# Altium project GAPses_breakout_pcb.PrjPcb
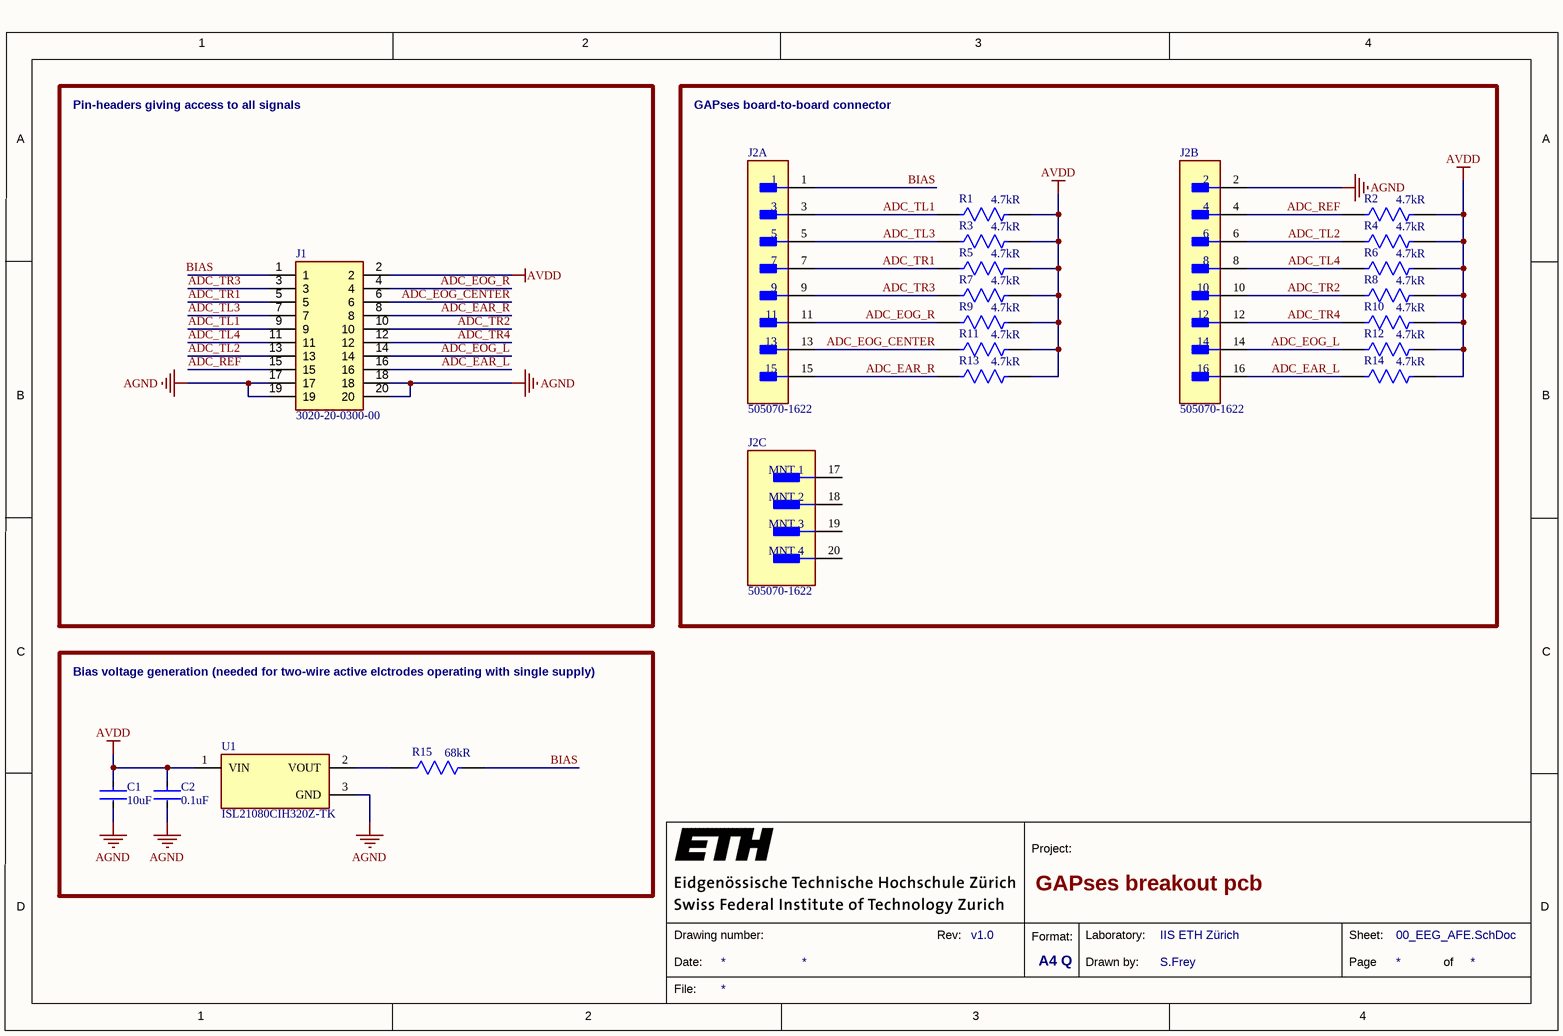
[diagram p0: 00_EEG_AFE.SchDoc]
DrawnBy: S.Frey; Organization: IIS ETH Zürich; revision: v1.0; title: GAPses breakout pcb
1 sheet, 20 parts. Net scope: global (net labels, ports and power ports of the same name join across sheets).
Board file: breakout_pcb.PcbDoc

## Sheet 00_EEG_AFE.SchDoc: GAPses breakout pcb
size A4

### Parts
C1  Capacitance: 10uF  [FP-CL07-IPC_C]  (hidden comment: CL05A106MP8NUB8)
C2  Capacitance: 0.1uF  [FP-CL278-IPC_C]  (hidden comment: CL05A104KA5NNNC)
J1  3020-20-0300-00  [302020030000]
J2  505070-1622  [FP-505070-1622-MFG]  (parts A,B,C of 3)
R1  Resistance: 4.7kR  [FP-RR0510-IPC_C]  (hidden comment: RR0510P-472-D)
R2  Resistance: 4.7kR  [FP-RR0510-IPC_C]  (hidden comment: RR0510P-472-D)
R3  Resistance: 4.7kR  [FP-RR0510-IPC_C]  (hidden comment: RR0510P-472-D)
R4  Resistance: 4.7kR  [FP-RR0510-IPC_C]  (hidden comment: RR0510P-472-D)
R5  Resistance: 4.7kR  [FP-RR0510-IPC_C]  (hidden comment: RR0510P-472-D)
R6  Resistance: 4.7kR  [FP-RR0510-IPC_C]  (hidden comment: RR0510P-472-D)
R7  Resistance: 4.7kR  [FP-RR0510-IPC_C]  (hidden comment: RR0510P-472-D)
R8  Resistance: 4.7kR  [FP-RR0510-IPC_C]  (hidden comment: RR0510P-472-D)
R9  Resistance: 4.7kR  [FP-RR0510-IPC_C]  (hidden comment: RR0510P-472-D)
R10  Resistance: 4.7kR  [FP-RR0510-IPC_C]  (hidden comment: RR0510P-472-D)
R11  Resistance: 4.7kR  [FP-RR0510-IPC_C]  (hidden comment: RR0510P-472-D)
R12  Resistance: 4.7kR  [FP-RR0510-IPC_C]  (hidden comment: RR0510P-472-D)
R13  Resistance: 4.7kR  [FP-RR0510-IPC_C]  (hidden comment: RR0510P-472-D)
R14  Resistance: 4.7kR  [FP-RR0510-IPC_C]  (hidden comment: RR0510P-472-D)
R15  Resistance: 68kR  [FP-RR0510-MFG]  (hidden comment: RR0510P-683-D)
U1  ISL21080CIH320Z-TK  [FP-P3_064A-IPC_C]

### Blocks framed on the sheet
Pin-headers giving access to all signals: J1
GAPses board-to-board connector: J2 R1-R14

### Nets
AGND: C1.2 C2.2 J1.17 J1.18 J1.19 J1.20 J2.2 U1.3(GND)
AVDD: C1.1 C2.1 J1.2 R1.2 R2.2 R3.2 R4.2 R5.2 R6.2 R7.2 R8.2 R9.2 R10.2 R11.2 R12.2 R13.2 R14.2 U1.1(VIN)
ADC_EAR_L: J1.16 J2.16 R14.1
ADC_EAR_R: J1.8 J2.15 R13.1
ADC_EOG_CENTER: J1.6 J2.13 R11.1
ADC_EOG_L: J1.14 J2.14 R12.1
ADC_EOG_R: J1.4 J2.11 R9.1
ADC_REF: J1.15 J2.4 R2.1
ADC_TL1: J1.9 J2.3 R1.1
ADC_TL2: J1.13 J2.6 R4.1
ADC_TL3: J1.7 J2.5 R3.1
ADC_TL4: J1.11 J2.8 R6.1
ADC_TR1: J1.5 J2.7 R5.1
ADC_TR2: J1.10 J2.10 R8.1
ADC_TR3: J1.3 J2.9 R7.1
ADC_TR4: J1.12 J2.12 R10.1
BIAS: J1.1 J2.1 R15.2
NetR15_1: R15.1 U1.2(VOUT)

Not connected (* = marked no-connect by the designer): J2 17(MNT_1) 18(MNT_2) 19(MNT_3) 20(MNT_4)

### Notes on the sheet
- Bias voltage generation (needed for two-wire active elctrodes operating with single supply)
- 1
- 2
- 3
- 4
- A
- B
- C
- Project:
- D
- Date:
- Drawing number:
- Rev:
- Format:
- A4 Q
- Drawn by:
- Laboratory:
- Page
- Sheet:
- of
- File:

### Library data of the parts
C1 = CMP-13271-002778-1: Cap Ceramic 10uF 10V X5R ±20% SMD 0402 +85°C Paper T/R; Length: 0.039inch; Mount: Surface Mount; Case Code (Imperial): 0402; Max Operating Temperature: 85°C; Voltage Rating: 10V; Min Operating Temperature: -55°C; Case/Package: 0402; Thickness: 0.035inch; Width: 0.02inch; Case Code (Metric): 1005; Packaging: Tape and Reel; Tolerance: 20%
C2 = CMP-13271-000728-1: Cap Ceramic 100nF 25V X5R ±10% SMD 0402 +85°C Paper T/R; Package Quantity: 1; Height: 0.5mm; Case Code (Metric): 1005; Thickness: 0.022inch; Mount: Surface Mount; Lead Free: Lead Free; Case Code (Imperial): 0402; Packaging: Tape and Reel; Depth: 0.5mm; Voltage: 25V; Min Operating Temperature: -55°C; Voltage Rating: 25V; Dielectric: X5R; Case/Package: 0402; Tolerance: 10%; Width: 0.02inch; Max Operating Temperature: 85°C; Length: 1mm; Radiation Hardening: No; Voltage Rating (DC): 25V
J1 = 3020-20-0300-00: Connector; Manufacturer_Name: CNC Tech; Datasheet Link: http://cnctech.us/pdfs/3020-XX-0300-00.pdf; Height: 9mm; Manufacturer_Part_Number: 3020-20-0300-00; Arrow Part Number: 3020-20-0300-00; Arrow Price/Stock: https://www.arrow.com/en/products/3020-20-0300-00/cnc-tech-llc?region=nac
J2 = CMP-04776-000181-1: CONN PLUG 16POS SMD GOLD
R1-R14 = CMP-2002-01621-2: 4.7kΩ ±0.5% 0.0625W 1/16W Chip Resistor 0402 (1005 Metric) Thin Film; Temperature Coefficient: 25ppm/°C; Voltage Rating: 25V; Power Rating: 63mW; Tolerance: 0.5%; Size Code: 0402; Lead Free: Lead Free; Length: 0.039inch; Termination: SMD/SMT; Resistor Type: Thin Film; Voltage Rating (DC): 25V; Resistance Tolerance: 0.5%; Packaging: Cut Tape; Case/Package: 0402; Number of Terminations: 2; Width: 0.02inch; Height: 0.016inch; Case Code (Metric): 1005; Min Operating Temperature: -55°C; Max Power Dissipation: 63mW; RoHS Compliant: Yes; Series: RR; Weight: 2.3E-05oz; Number of Pins: 2; Case Code (Imperial): 0402; Max Operating Temperature: 125°C; Package Quantity: 1
R15 = CMP-2002-01647-2: 68kΩ ±0.5% 0.0625W 1/16W Chip Resistor 0402 (1005 Metric) Thin Film; Temperature Coefficient: 25ppm/°C; Voltage Rating: 25V; Max Power Dissipation: 63mW; Power Rating: 62.5mW; Termination: SMD/SMT; Min Operating Temperature: -55°C; Case Code (Imperial): 0402; Resistance Tolerance: 0.5%; Series: RR; Max Operating Temperature: 125°C; Tolerance: 0.5%; Size Code: 0402; Number of Pins: 2; Packaging: Tape and Reel; Case Code (Metric): 1005; Number of Terminations: 2; Voltage Rating (DC): 25V; RoHS Compliant: Yes; Width: 0.5mm; Weight: 2.3E-05oz; Lead Free: Lead Free; Resistor Type: Thin Film; Height: 0.35mm; Length: 1mm; Case/Package: 0402
U1 = CMP-13559-000004-1: IC VREF SERIES 0.3% SOT23-3; Operating Supply Current: 1.5uA; Temperature Coefficient: 50ppm/°C; Output Type: Fixed; Output Current: 7mA; Min Output Voltage: 2.048V; Tolerance: 0.3%; Packaging: Tape and Reel; RoHS Compliant: Yes; Reference Type: Series; Min Operating Temperature: -40°C; Max Operating Temperature: 85°C; Mount: Surface Mount; Case/Package: TO-236-3

## Assembly variants
Only fitted: all parts fitted